# Altium schematic sheet temp_sense.SchDoc
size A
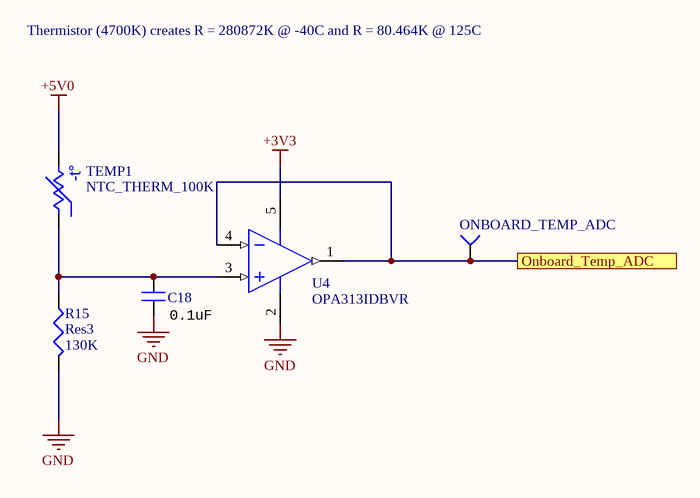
[diagram p0: temp_sense.SchDoc]

## Parts
C18  value 0.1uF  [CAPC0603(1608)55_N]
ONBOARD_TEMP_ADC  ONBOARD_TEMP_ADC  [TESTPOINT]  (value not drawn)
R15  Res3  value 130K  [J1-0603]
TEMP1  NTC_THERM_100K  [RESC0603(1608)_N]
U4  OPA313IDBVR  [DBV0005A_M]

## Ports
Onboard_Temp_ADC

## Nets
+3V3: U4.5(V+)
+5V0: TEMP1.1
GND: C18.1 R15.2 U4.2(V-)
Onboard_Temp_ADC: ONBOARD_TEMP_ADC.1(=value) U4.1(OUT) U4.4(IN-) ; port Onboard_Temp_ADC
NetC18_2: C18.2 R15.1 TEMP1.2 U4.3(IN+)

## Notes on the sheet
- Thermistor (4700K) creates R = 280872K @ -40C and R = 80.464K @ 125C
- (in symbol NTC_THERM_100K) -t°

## Library data of the parts
C18 = CAP_0.1uF_16V_0603: CAP CER 0.1UF 16V X7R 0603; MPN: CC0603KRX7R7BB104; Manufacturer: Yageo; Dimensions: 0.063" L x 0.031" W (1.60mm x 0.80mm); Package: 0603 (1608 Metric); Temperature Coefficient: X7R; Voltage Rating: 16V; Digikey Part Number: 311-1088-1-ND
ONBOARD_TEMP_ADC = TESTPOINT_SMD: Part Number (MPN): *
R15 = Res3: Resistor; Published: 8-Jun-2000; LatestRevisionDate: 29-May-2009; LatestRevisionNote: IPC-7351 Footprint Added.; PackageReference: J1-0603; Publisher: Altium Limited; PackageDescription: Chip Resistor
TEMP1 = NTC_THERM_100K: THERM NTC 100KOHM 4700K 0603; MPN: ERT-J1VV104J; Manufacturer: Panasonic; Value: 100K; Digikey Part Number: P10555CT-ND
U4 = OPAMP: 1-MHz, Micropower, Low-Noise, Rail-to-Rail I/O Operational Amplifier, 1.8 to 5.5 V, -40 to 125 degC, 5-pin SOT23 (DBV5), Green (RoHS & no Sb/Br); Manufacturer: Texas Instruments; Offset Drift(Typ)(uV/C): 2; Rating: Catalog; Packing: LARGE T&R; SubFamily: Low Input Bias Current Amp (<=10pA), Low Power Amp (<=500uA); Number of Channels: 1; Vio (25C)(Max)(mV): 2.5; Total Supply Voltage(Min)(+5V is 5, +/-5V is 10): 1.8; CMRR(Min)(dB): 70; Total Supply Voltage(Max)(+5V is 5, +/-5V is 10): 5.5; Iq per channel(Max)(mA): 0.06; Slew Rate(Typ)(V/us): 0.5; ComponentLink1Description: Manufacturer URL; PackageVersion: 4073253-4/K, 03/2006; ComponentLink2Description: Datasheet; Code_JEDEC: MO-178; GBW(Typ)(MHz): 1; Eco-Plan: Green (RoHS & no Sb/Br); ComponentLink3Description: Package Specification; PartNumber: OPA313IDBVR; PackageReference: DBV0005A; Mounting Technology: Surface Mount; PackageDescription: 5-Pin Plastic Small Outline, Body 1.6 x 2.9 mm, Pitch 0.95 mm; ComponentLink1URL: http://www.ti.com/; DatasheetVersion: SBOS649C; ComponentLink2URL: http://www.ti.com/lit/ds/symlink/opa313.pdf; ComponentLink3URL: http://www.ti.com/litv/pdf/mpds018i; Digi-Key Part Number: 296-35607-1-ND